# EAGLE design uni_Multi-Out (EAGLE 9.6.1)
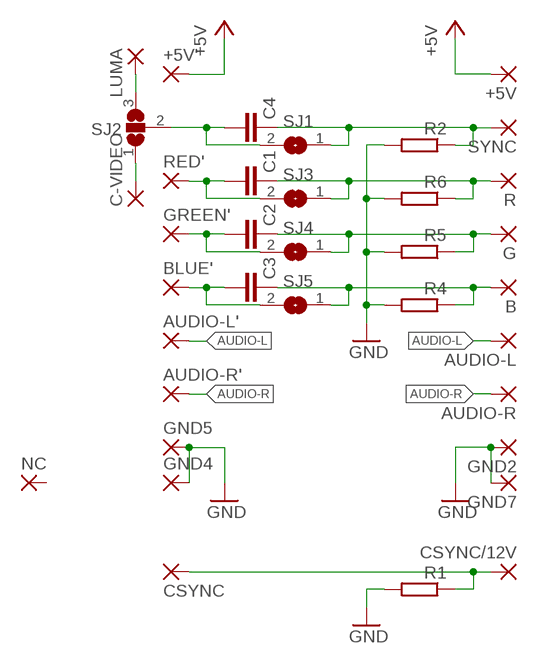
[diagram p0: schematic, sheet 1]

## Parts
+5V  WIREPADSMD1,27-254  [SMD1,27-2,54]
+5V'  WIREPADSMD1,27-254  [SMD1,27-2,54]
AUDIO-L  WIREPADSMD1,27-254  [SMD1,27-2,54]
AUDIO-L'  WIREPADSMD1,27-254  [SMD1,27-2,54]
AUDIO-R  WIREPADSMD1,27-254  [SMD1,27-2,54]
AUDIO-R'  WIREPADSMD1,27-254  [SMD1,27-2,54]
B  WIREPADSMD1,27-254  [SMD1,27-2,54]
BLUE'  WIREPADSMD1,27-254  [SMD1,27-2,54]
C1  C-EUC1206  [C1206]
C2  C-EUC1206  [C1206]
C3  C-EUC1206  [C1206]
C4  C-EUC1206  [C1206]
C-VIDEO  WIREPADSMD1,27-254  [SMD1,27-2,54]
CSYNC  WIREPADSMD1,27-254  [SMD1,27-2,54]
CSYNC/12V  WIREPADSMD1,27-254  [SMD1,27-2,54]
G  WIREPADSMD1,27-254  [SMD1,27-2,54]
GND2  WIREPADSMD1,27-254  [SMD1,27-2,54]
GND4  WIREPADSMD1,27-254  [SMD1,27-2,54]
GND5  WIREPADSMD1,27-254  [SMD1,27-2,54]
GND7  WIREPADSMD1,27-254  [SMD1,27-2,54]
GREEN'  WIREPADSMD1,27-254  [SMD1,27-2,54]
LUMA  WIREPADSMD1,27-254  [SMD1,27-2,54]
NC  WIREPADSMD1,27-254  [SMD1,27-2,54]
R  WIREPADSMD1,27-254  [SMD1,27-2,54]
R1  R-EU_R0805  [R0805]
R2  R-EU_R0805  [R0805]
R4  R-EU_R0805  [R0805]
R5  R-EU_R0805  [R0805]
R6  R-EU_R0805  [R0805]
RED'  WIREPADSMD1,27-254  [SMD1,27-2,54]
SJ1  SJ  [SJ]
SJ2  SJ2W  [SJ_2]
SJ3  SJ  [SJ]
SJ4  SJ  [SJ]
SJ5  SJ  [SJ]
SYNC  WIREPADSMD1,27-254  [SMD1,27-2,54]

## Nets
+5V: +5V'.1(P) +5V.1(P)
AUDIO-L: AUDIO-L'.1(P) AUDIO-L.1(P)
AUDIO-R: AUDIO-R'.1(P) AUDIO-R.1(P)
BLUE': B.1(P) C3.1 R4.1 SJ5.1
BLUE'': BLUE'.1(P) C3.2 SJ5.2
C-VIDEO: C-VIDEO.1(P) SJ2.1
CSYNC/+12V: CSYNC.1(P) CSYNC/12V.1(P) R1.1
GND: GND2.1(P) GND4.1(P) GND5.1(P) GND7.1(P) R1.2 R2.2 R4.2 R5.2 R6.2
GREEN': C2.1 G.1(P) R5.1 SJ4.1
GREEN'': C2.2 GREEN'.1(P) SJ4.2
LUMA: LUMA.1(P) SJ2.3
N$2: C4.2 SJ1.2 SJ2.2
RED': C1.1 R6.1 R.1(P) SJ3.1
RED'': C1.2 RED'.1(P) SJ3.2
SYNC: C4.1 R2.1 SJ1.1 SYNC.1(P)
Unconnected: NC.1(P)

## Library data of the parts
+5V +5V' AUDIO-L AUDIO-L' AUDIO-R AUDIO-R' B BLUE' C-VIDEO CSYNC CSYNC/12V G GND2 GND4 GND5 GND7 GREEN' LUMA NC R RED' SYNC = wirepad:WIREPAD: Wire PAD connect wire on PCB
C1 C4 = rcl:C-EU: CAPACITOR, European symbol; SPICEPREFIX: C
C2 C3 = resistor:C-EU: CAPACITOR, European symbol
R1 R2 R4-R6 = rcl:R-EU_: RESISTOR, European symbol; SPICEPREFIX: R
SJ1 SJ3-SJ5 = jumper:SJ: SMD solder JUMPER
SJ2 = jumper:SJ2W: SMD solder JUMPER

## Board
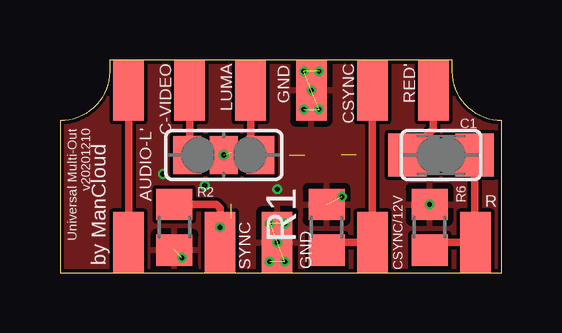
[diagram p1: board, top side]
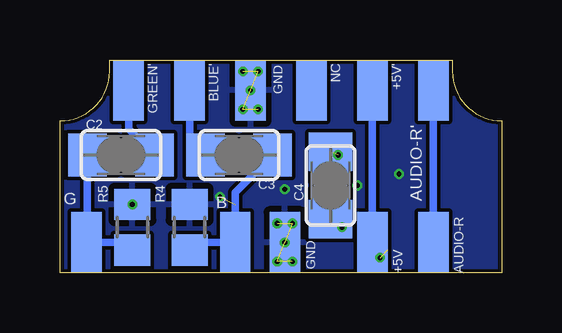
[diagram p2: board, bottom side, seen from below]

Size 18.41 x 8.89 mm. Coordinates in mm from the lower left corner, seen from the top.
Outline: 0,0 18.41,0 18.41,6.35 arc-90 16.35,8.41 16.35,8.89 2.06,8.89 2.06,8.41 arc-90 0,6.35 0,0
Copper layers (1*16): Top 0.035mm / dielectric 1.5mm / Bottom 0.035mm
Design rules "default *": minimum track width 6mil, minimum drill 0.2mm, track to track 6mil, track to pad 6mil, pad to pad 6mil, via to via 6mil, smd to smd 6mil, copper to edge 6mil, drill to drill 6mil, minimum pad ring 10mil, minimum via ring 4mil, stop-mask expansion 4mil, vias tented up to drill 0mil, thermal gap 10mil

### Footprints (pad centres in the part's own frame; a part is rotated, then mirrored left to right if it is on the bottom)
SMD1,27-2,54 = smd 1.27 x 2.54: 1 0,0
C1206 = smd 1.6 x 1.8: 1 -1.4,0; 2 1.4,0
R0805 = smd 1.3 x 1.5: 1 -0.95,0; 2 0.95,0
SJ = smd 1.168 x 1.6: 1 -0.762,0; 2 0.762,0
SJ_2 = smd 1.168 x 1.6: 1 -1.524,0; 2 0,0; 3 1.524,0

### Placement (x,y rotation side)
+5V  5.4,1.27 0 bottom
+5V'  5.4,7.62 0 bottom
AUDIO-L  2.86,1.27 0 top
AUDIO-L'  2.86,7.62 0 top
AUDIO-R  2.86,1.27 0 bottom
AUDIO-R'  2.86,7.62 0 bottom
B  11.11,1.27 0 bottom
BLUE'  13.02,7.62 0 bottom
C1  15.88,4.92 180 top
C2  15.88,4.92 0 bottom
C3  10.95,4.92 180 bottom
C4  7.14,3.65 90 bottom
C-VIDEO  5.4,7.62 0 top
CSYNC  13.02,7.62 0 top
CSYNC/12V  13.02,1.27 0 top
G  17.3,1.27 0 bottom
GND2  9.05,1.27 0 bottom
GND4  10.48,7.62 0 top
GND5  10.48,7.62 0 bottom
GND7  9.05,1.27 0 top
GREEN'  15.56,7.62 0 bottom
LUMA  7.94,7.62 0 top
NC  7.94,7.62 0 bottom
R  17.3,1.27 180 top
R1  11.11,1.91 90 top
R2  4.76,1.91 270 top
R4  13.02,1.91 90 bottom
R5  15.4,1.91 90 bottom
R6  15.4,1.91 90 top
RED'  15.56,7.62 0 top
SJ1  7.14,3.65 90 bottom
SJ2  6.83,4.92 0 top
SJ3  15.88,4.92 180 top
SJ4  15.88,4.92 0 bottom
SJ5  10.95,4.92 180 bottom
SYNC  6.67,1.27 0 top

### Tracks (layer width: path | path; a pad name or v marks a point on that pad's centre or on a via)
+5V
  Bottom 0.305: +5V'.1 +5V.1
AUDIO-L
  Top 0.305: AUDIO-L'.1 AUDIO-L.1
AUDIO-R
  Bottom 0.305: AUDIO-R'.1 AUDIO-R.1
BLUE'  (1 unrouted)
  Bottom 0.305: C3.1 11.11,3.36 B.1 12.7,1.27 R4.1
BLUE''  (1 unrouted)
  Bottom 0.305: BLUE'.1 13.02,5.58 C3.2
C-VIDEO
  Top 0.305: C-VIDEO.1 5.4,5.02 SJ2.1
CSYNC/+12V
  Top 0.305: CSYNC.1 CSYNC/12V.1 11.43,1.27 R1.1
GND  (via drill 0.2)  (10 unrouted)
  other vias: 9.05,1.27 11.75,3.17 15.4,2.86 10.48,7.62 9.05,3.49 4.29,4.13 6.03,3.65 5.08,0.64 10.16,8.41 10.79,8.41 10.79,6.83 10.16,6.83 8.73,2.06 9.37,2.06 9.37,0.48 8.73,0.48
  pour Top: 2.06,8.89 2.06,8.38 arc-90 0.04,6.35 0.16,0.16 18.33,0.16 18.41,6.35 arc-90 16.43,8.33 16.43,8.89
  pour Bottom: 16.35,8.84 16.35,8.4 arc90 18.4,6.35 18.33,0.16 0.16,0.16 0.03,6.35 arc90 2.06,8.39 2.06,8.84
GREEN'  (1 unrouted)
  Bottom 0.305: C2.1 17.27,1.3 G.1 15.71,1.27 R5.1
GREEN''  (1 unrouted)
  Bottom 0.305: GREEN'.1 15.56,6 C2.2
LUMA
  Top 0.305: LUMA.1 7.94,5.33 SJ2.3
N$2  (via drill 0.2)  (1 unrouted)
  Bottom 0.305: SJ1.2 6.83,4.73 SJ2.2
  other vias: 6.83,4.92
RED'  (1 unrouted)
  Top 0.305: C1.1 17.27,1.3 R.1 15.71,1.27 R6.1
RED''  (1 unrouted)
  Top 0.305: RED'.1 15.56,6 C1.2
SYNC  (via drill 0.2)  (1 unrouted)
  Top 0.305: R2.1 6.51,2.86 6.67,2.7 v6.67,1.91 SYNC.1
  Bottom 0.305: C4.1 7.01,2.25 v6.67,1.91

### Text on the board
tNames: GND | Universal Multi-Out / v20201210 | by ManCloud | GND
bNames: GND | GND